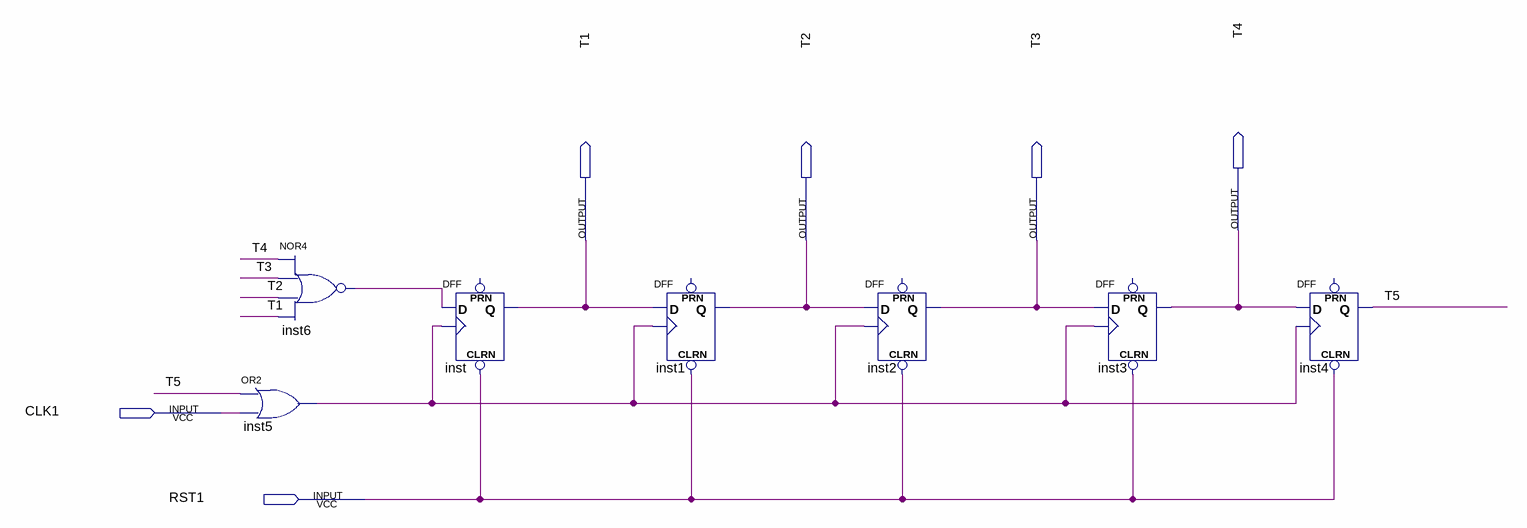
[diagram p0: schematic sheet]
// Quartus schematic step2.bdf as structural Verilog: 7 symbols, 6 pins
module step2 (
  input  CLK1,
  input  RST1,
  output T4,
  output T1,
  output T2,
  output T3
);

  wire inst5_out, inst6_out, T5;

  or inst5 (inst5_out, T5, CLK1);
  nor inst6 (inst6_out, T4, T3, T2, T1);
  DFF inst (.CLRN(RST1), .CLK(inst5_out), .D(inst6_out), .Q(T1));  // open: PRN
  DFF inst1 (.CLRN(RST1), .CLK(inst5_out), .D(T1), .Q(T2));  // open: PRN
  DFF inst2 (.CLRN(RST1), .CLK(inst5_out), .D(T2), .Q(T3));  // open: PRN
  DFF inst3 (.CLRN(RST1), .CLK(inst5_out), .D(T3), .Q(T4));  // open: PRN
  DFF inst4 (.CLRN(RST1), .CLK(inst5_out), .D(T4), .Q(T5));  // open: PRN
endmodule
